# Altium schematic sheet MSP430F149.SCHDOC
size A4; Organization: UNSW Solar Racing Team; Address3: UNSW; Address4: Sydney NSW 2052; Address2: Electrical Engineering; Address1: Rm 109
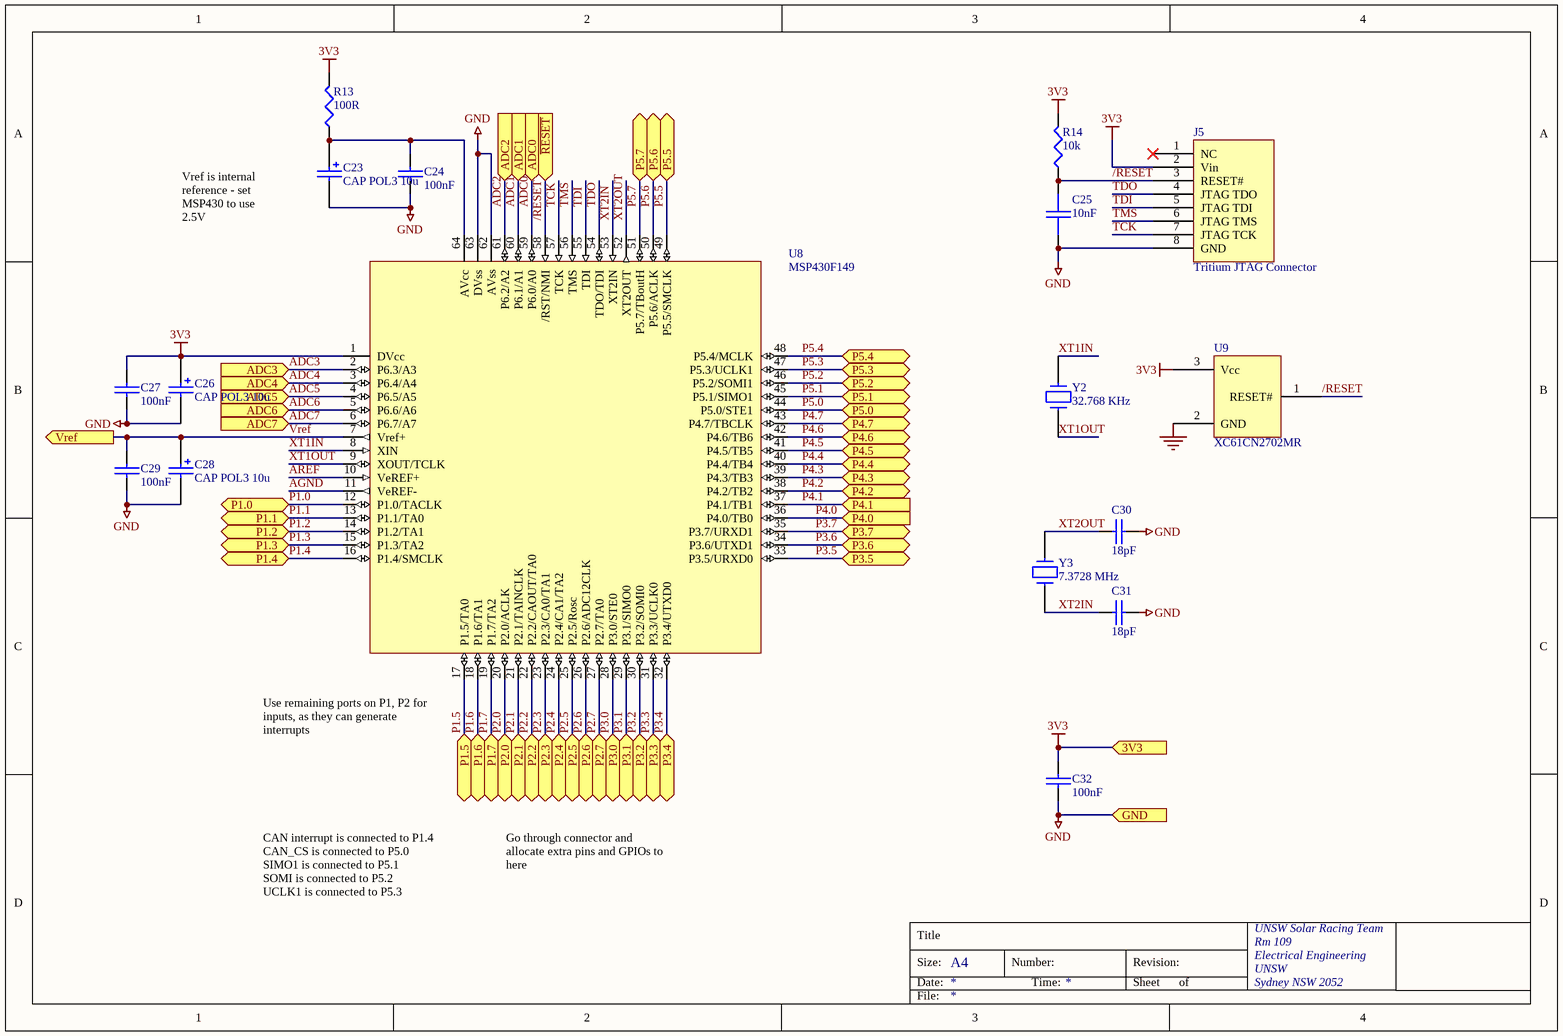
[diagram p0: MSP430F149.SCHDOC]

## Parts
C23  CAP POL3 10u  [MCCT-CASEA]
C24  100nF  [0603]
C25  10nF  [0603]
C26  CAP POL3 10u  [MCCT-CASEA]
C27  100nF  [0603]
C28  CAP POL3 10u  [MCCT-CASEA]
C29  100nF  [0603]
C30  18pF  [0603]
C31  18pF  [0603]
C32  100nF  [0603]
J5  Tritium JTAG Connector  [HDR2X5]
R13  100R  [0603]
R14  10k  [0603]
U8  MSP430F149  [QFP64]
U9  XC61CN2702MR  [SOT23-3]
Y2  32.768 KHz  [WATCHA]
Y3  7.3728 MHz  [HC49/4H]

## Ports
3V3, ADC0 (in), ADC1 (in), ADC2 (in), ADC3 (in), ADC4 (in), ADC5 (in), ADC6 (in), ADC7 (in), GND, P1.0, P1.1, P1.2, P1.3, P1.4, P1.5, P1.6, P1.7, P2.0, P2.1, P2.2, P2.3, P2.4, P2.5, P2.6, P2.7, P3.0, P3.1, P3.2, P3.3, P3.4, P3.5, P3.6, P3.7, P4.0 (in), P4.1 (in), P4.2, P4.3, P4.4, P4.5, P4.6, P4.7, P5.0, P5.1, P5.2, P5.3, P5.4, P5.5, P5.6, P5.7, Vref (out), ~{RESET} (in)

## Nets
3V3: C26.1 C27.1 C32.1 J5.2(Vin) R13.2 R14.2 U8.1(DVcc) U9.3(Vcc) ; port 3V3
GND: C23.2 C24.2 C25.2 C26.2 C27.2 C28.2 C29.2 C30.2 C31.2 C32.2 J5.8(GND) U8.62(AVss) U8.63(DVss) U9.2(GND) ; port GND
/RESET: C25.1 J5.3(RESET#) R14.1 U8.58(/RST/NMI) U9.1(RESET#) ; port ~{RESET}
ADC0: U8.59(P6.0/A0) ; port ADC0
ADC1: U8.60(P6.1/A1) ; port ADC1
ADC2: U8.61(P6.2/A2) ; port ADC2
ADC3: U8.2(P6.3/A3) ; port ADC3
ADC4: U8.3(P6.4/A4) ; port ADC4
ADC5: U8.4(P6.5/A5) ; port ADC5
ADC6: U8.5(P6.6/A6) ; port ADC6
ADC7: U8.6(P6.7/A7) ; port ADC7
AGND: U8.11(VeREF-)
AREF: U8.10(VeREF+)
P1.0: U8.12(P1.0/TACLK) ; port P1.0
P1.1: U8.13(P1.1/TA0) ; port P1.1
P1.2: U8.14(P1.2/TA1) ; port P1.2
P1.3: U8.15(P1.3/TA2) ; port P1.3
P1.4: U8.16(P1.4/SMCLK) ; port P1.4
P1.5: U8.17(P1.5/TA0) ; port P1.5
P1.6: U8.18(P1.6/TA1) ; port P1.6
P1.7: U8.19(P1.7/TA2) ; port P1.7
P2.0: U8.20(P2.0/ACLK) ; port P2.0
P2.1: U8.21(P2.1/TAINCLK) ; port P2.1
P2.2: U8.22(P2.2/CAOUT/TA0) ; port P2.2
P2.3: U8.23(P2.3/CA0/TA1) ; port P2.3
P2.4: U8.24(P2.4/CA1/TA2) ; port P2.4
P2.5: U8.25(P2.5/Rosc) ; port P2.5
P2.6: U8.26(P2.6/ADC12CLK) ; port P2.6
P2.7: U8.27(P2.7/TA0) ; port P2.7
P3.0: U8.28(P3.0/STE0) ; port P3.0
P3.1: U8.29(P3.1/SIMO0) ; port P3.1
P3.2: U8.30(P3.2/SOMI0) ; port P3.2
P3.3: U8.31(P3.3/UCLK0) ; port P3.3
P3.4: U8.32(P3.4/UTXD0) ; port P3.4
P3.5: U8.33(P3.5/URXD0) ; port P3.5
P3.6: U8.34(P3.6/UTXD1) ; port P3.6
P3.7: U8.35(P3.7/URXD1) ; port P3.7
P4.0: U8.36(P4.0/TB0) ; port P4.0
P4.1: U8.37(P4.1/TB1) ; port P4.1
P4.2: U8.38(P4.2/TB2) ; port P4.2
P4.3: U8.39(P4.3/TB3) ; port P4.3
P4.4: U8.40(P4.4/TB4) ; port P4.4
P4.5: U8.41(P4.5/TB5) ; port P4.5
P4.6: U8.42(P4.6/TB6) ; port P4.6
P4.7: U8.43(P4.7/TBCLK) ; port P4.7
P5.0: U8.44(P5.0/STE1) ; port P5.0
P5.1: U8.45(P5.1/SIMO1) ; port P5.1
P5.2: U8.46(P5.2/SOMI1) ; port P5.2
P5.3: U8.47(P5.3/UCLK1) ; port P5.3
P5.4: U8.48(P5.4/MCLK) ; port P5.4
P5.5: U8.49(P5.5/SMCLK) ; port P5.5
P5.6: U8.50(P5.6/ACLK) ; port P5.6
P5.7: U8.51(P5.7/TBoutH) ; port P5.7
TCK: J5.7(JTAG_TCK) U8.57(TCK)
TDI: J5.5(JTAG_TDI) U8.55(TDI)
TDO: J5.4(JTAG_TDO) U8.54(TDO/TDI)
TMS: J5.6(JTAG_TMS) U8.56(TMS)
Vref: C28.1 C29.1 U8.7(Vref+) ; port Vref
XT1IN: U8.8(XIN) Y2.2
XT1OUT: U8.9(XOUT/TCLK) Y2.1
XT2IN: C31.1 U8.53(XT2IN) Y3.1
XT2OUT: C30.1 U8.52(XT2OUT) Y3.2
NetC23_1: C23.1 C24.1 R13.1 U8.64(AVcc)

Not connected (* = marked no-connect by the designer): J5 1(NC)*

## Notes on the sheet
- Vref is internal reference - set MSP430 to use 2.5V
- (near U8) Use remaining ports on P1, P2 for inputs, as they can generate interrupts
- CAN interrupt is connected to P1.4
  CAN_CS is connected to P5.0
  SIMO1 is connected to P5.1
  SOMI is connected to P5.2
  UCLK1 is connected to P5.3
- Go through connector and allocate extra pins and GPIOs to here
- Title
- Size:
- Date:
- A4
- Number:
- Time:
- Revision:
- Sheet
- of
- File:

## Library data of the parts
C23 C26 C28 = CAP POL3: Polarized Capacitor (Surface Mount); Revision: July-2002: Re-released for DXP Platform.; Digikey: 478-3121-1-ND; DigikeyPrice: 0.41; Farnell: 1432264; FarnellPrice: 0.30
C24 C25 C27 C29-C32 = CAP: Capacitor
  C24 C27 C29 C32: Farnell: 753-567; Price: 0.30
  C25: Farnell: 722-236; Price: 0.11
  C30 C31: Farnell: 721-992; Price: 0.10
J5 = 430F_JTAG_TRITIUM: Tritium JTAG interface for MSP430; Extra parts: 672-520, 672-555; Farnell: 1022233; Price: 2.19
R13 R14 = RES1: Resistor; Price: 0.11
  R13: Farnell: 612-364
  R14: Farnell: 612-601
U8 = MSP430F14X: Farnell: NA
U9 = XC61F: SOT23 reset generator; Farnell: 3605449; FarnellPrice: 1.42; Digikey: -
Y2 Y3 = CRYSTAL
  Y2: Farnell: 9509682; FarnellPrice: 2.14; Digikey: 300-8301-ND; DigikeyPrice: 0.28
  Y3: Farnell: 7940385; FarnellPrice: 0.835; Digikey: X1056-ND; DigikeyPrice: 0.58